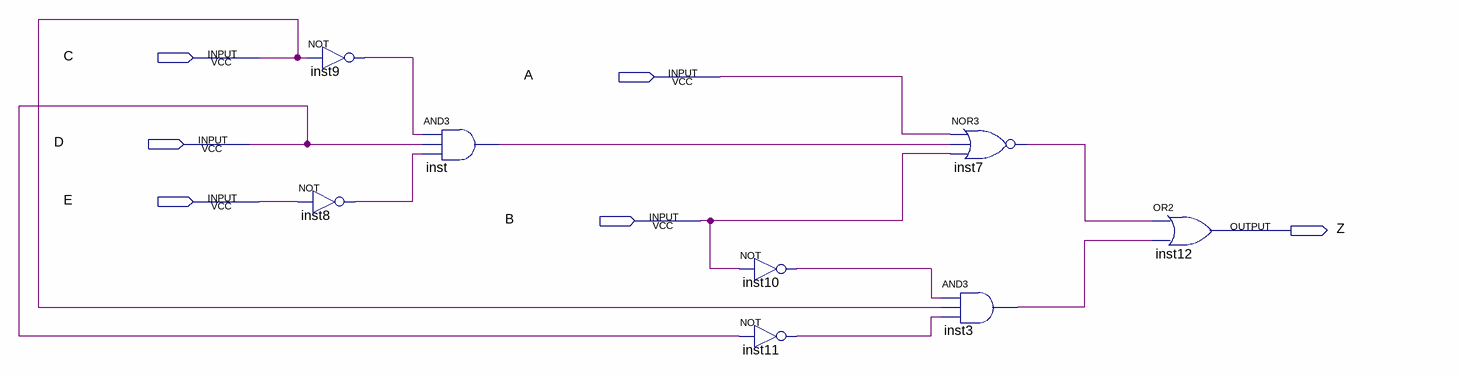
[diagram p0: schematic sheet]
// Quartus schematic LetraB.bdf as structural Verilog: 8 symbols, 6 pins
module LetraB (
  input  C,
  input  A,
  input  D,
  input  E,
  input  B,
  output Z
);

  wire inst3_out, inst7_out, inst8_out, inst9_out, inst10_out, inst11_out, inst_out;

  not inst9 (inst9_out, C);
  not inst8 (inst8_out, E);
  and inst (inst_out, inst9_out, D, inst8_out);
  not inst10 (inst10_out, B);
  not inst11 (inst11_out, D);
  nor inst7 (inst7_out, A, inst_out, B);
  and inst3 (inst3_out, inst10_out, C, inst11_out);
  or inst12 (Z, inst7_out, inst3_out);
endmodule
